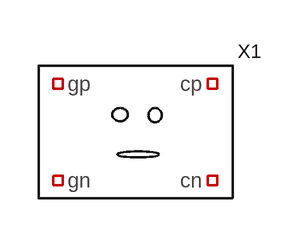
[diagram p0: schematic Draft4.asc]
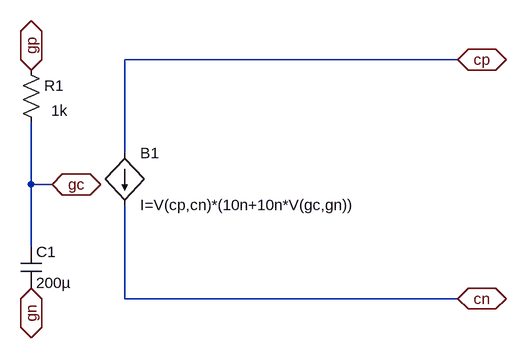
[diagram p1: sub-circuit symbolique.asc]
Draft4.asc, the LTspice schematic file:
Version 4
SHEET 1 880 680
SYMBOL Symbolique 176 144 R0
SYMATTR InstName X1

symbolique.asc, the sub-circuit schematic file:
Version 4
SHEET 1 880 680
WIRE 608 -48 96 -48
WIRE 96 96 96 -48
WIRE -48 144 -48 48
WIRE -16 144 -48 144
WIRE -48 240 -48 144
WIRE 96 320 96 176
WIRE 608 320 96 320
FLAG 608 -48 cp
IOPIN 608 -48 BiDir
FLAG 608 320 cn
IOPIN 608 320 BiDir
FLAG -48 -32 gp
IOPIN -48 -32 BiDir
FLAG -48 304 gn
IOPIN -48 304 BiDir
FLAG -16 144 gc
IOPIN -16 144 BiDir
SYMBOL bi 96 96 R0
SYMATTR InstName B1
SYMATTR Value I=V(cp,cn)*(10n+10n*V(gc,gn))
SYMBOL res -64 -48 R0
WINDOW 3 47 78 Left 2
SYMATTR InstName R1
SYMATTR Value 1k
SYMBOL cap -64 240 R0
SYMATTR InstName C1
SYMATTR Value 200µ

The netlist it stands for:
* Draft4.asc
XX1 NC_01 NC_02 NC_03 NC_04 symbolique

* block symbol definitions
.subckt symbolique cp cn gp gn
B1 cp cn I=V(cp,cn)*(10n+10n*V(gc,gn))
R1 gp gc 1k
C1 gc gn 200µ
.ends symbolique

.backanno
.end